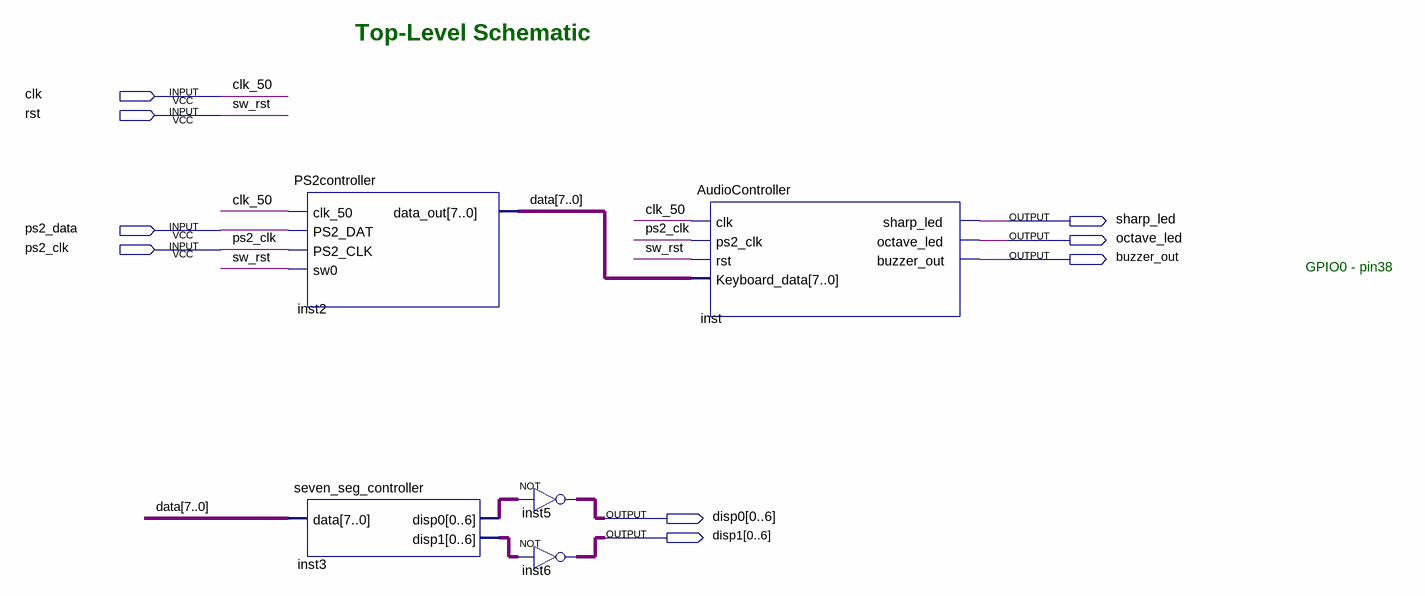
[diagram p0: schematic sheet]
// Quartus schematic TopLevel.bdf as structural Verilog: 5 symbols, 9 pins
module TopLevel (
  input  clk,
  input  rst,
  input  ps2_data,
  input  ps2_clk,
  output sharp_led,
  output octave_led,
  output buzzer_out,
  output [0:6] disp0,
  output [0:6] disp1
);

  wire [6:0] inst3_disp0, inst3_disp1;
  wire [7:0] data;

  PS2controller inst2 (.clk_50(clk), .PS2_DAT(ps2_data), .PS2_CLK(ps2_clk), .sw0(rst), .data_out(data));
  seven_seg_controller inst3 (.data(data), .disp0(inst3_disp0), .disp1(inst3_disp1));
  assign disp0 = ~inst3_disp0;  // NOT inst5, 7 bits wide
  assign disp1 = ~inst3_disp1;  // NOT inst6, 7 bits wide
  AudioController inst (
    .clk(clk), .ps2_clk(ps2_clk), .rst(rst), .Keyboard_data(data), .sharp_led(sharp_led),
    .octave_led(octave_led), .buzzer_out(buzzer_out));

  // Other names for the same wires on the sheet: clk_50 = clk; sw_rst = rst

  // Notes on the sheet:
  //   Top-Level Schematic
  //   GPIO0 - pin38
endmodule
